# EAGLE design Raspi-On-Off_PMos_SMD_nl (EAGLE 7.4.0)
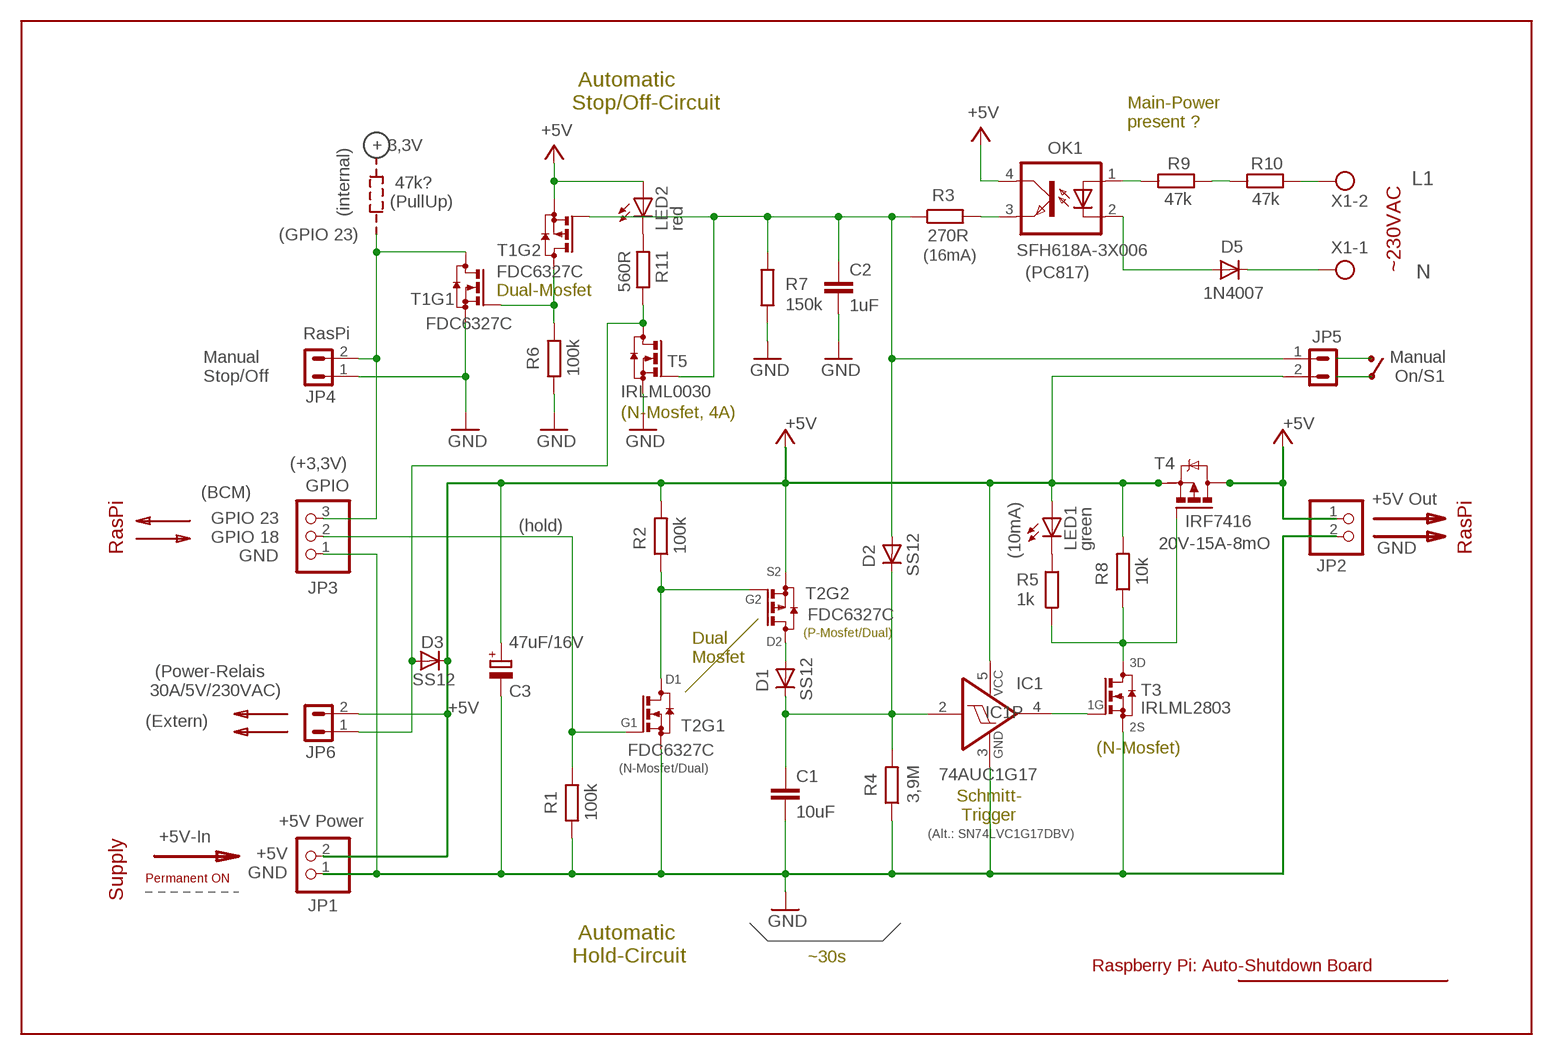
[diagram p0: schematic, sheet 1]

## Parts
C1  10uF  C-EUC1206  [C1206]
C2  1uF  C-EUC0805  [C0805]
C3  47uF/16V  CPOL-EUE2.5-6  [E2,5-6]
D1  SS12  MBR0520LT  [SOD123]
D2  SS12  MBR0520LT  [SOD123]
D3  SS12  MBR0520LT  [SOD123]
D5  1N4007  1N4004  [DO41-10]
IC1  74AUC1G17  74AUC1G17DBV  [SOT23-5]
JP1  +5V Power  PINHD-1X2  [1X02]
JP2  RasPi  PINHD-1X2  [1X02]
JP3  GPIO  PINHD-1X3  [1X03]
JP4  RasPi  MA02-11  [MA02-1R]
JP5  On  MA02-11  [MA02-1R]
JP6  Relais  MA02-11  [MA02-1R]
LED1  green  LED3MM  [LED3MM]
LED2  red  LED3MM  [LED3MM]
OK1  SFH618A-3X006  [DIP4-400]
R1  100k  R-EU_R0805  [R0805]
R2  100k  R-EU_R0805  [R0805]
R3  270R  R-EU_R0805  [R0805]
R4  3,9M  R-EU_R0805  [R0805]
R5  1k  R-EU_R0805  [R0805]
R6  100k  R-EU_R0805  [R0805]
R7  150k  R-EU_R0805  [R0805]
R8  10k  R-EU_R0805  [R0805]
R11  560R  R-EU_R0805  [R0805]
T1  FDC6327C  NP_MOSFET_SOT23-6  [SOT23-6]
T2  FDC6327C  NP_MOSFET_SOT23-6  [SOT23-6]
T3  IRLML2803  BSS12323  [SOT23]
T4  IRF7416  P-MOSFET-SO8  [SO-08]
T5  IRLML0030  BSS12323  [SOT23]
X1  MKDSN1,5/2-5,08  [MKDSN1,5/2-5,08]

## Nets
+5V: C3.+ D3.C IC1.5(VCC) JP1.2 JP5.2 JP6.2 LED1.A LED2.A OK1.4(COL) R2.2 R8.2 T1.2(S) T2.2(S) T4.1(S) T4.2(S) T4.3(S)
GND: C1.2 C2.2 C3.- IC1.3(GND) JP1.1 JP2.2 JP3.1 JP4.1 R1.1 R4.1 R6.1 R7.2 T1.5(S) T2.5(S) T3.2(S) T5.2(S)
N$1: JP2.1 T4.5(D) T4.6(D) T4.7(D) T4.8(D)
N$2: JP3.3 JP4.2 T1.6(D)
N$3: LED1.K(C) R5.2
N$4: R5.1 R8.1 T3.3(D) T4.4(G)
N$5: JP3.2 R1.2 T2.1(G)
N$6: D1.A T2.4(D)
N$7: C1.1 D1.C D2.C IC1.2(I) R4.2
N$8: C2.1 D2.A JP5.1 R3.1 R7.1 T1.3(G) T5.1(G)
N$9: R2.1 T2.3(G) T2.6(D)
N$10: OK1.3(EMIT) R3.2
N$11: R6.2 T1.1(G) T1.4(D)
N$13: OK1.1(A)
N$14: D5.A OK1.2(C)
N$15: D5.C X1.1
N$16: D3.A JP6.1 R11.1 T5.3(D)
N$17: LED2.K(C) R11.2
N$18: X1.2
N$26: IC1.4(O) T3.1(G)

## Notes on the sheet
- Automatic
  Stop/Off-Circuit
- Main-Power
  present ?
- + 3,3V
- R9 | R10
- L1
- 47k | 47k
- 47k?
  (PullUp)
- (internal)
- (GPIO 23)
- (16mA)
- ~230VAC
- (PC817) | N
- Dual-Mosfet
- Manual
  Stop/Off
- Manual
   On/S1
- (N-Mosfet, 4A)
- (+3,3V)
- (BCM)
- +5V Out
- GPIO 23
  GPIO 18
  GND
- (hold)
- RasPi | 20V-15A-8mO | GND | RasPi
- (10mA)
- S2
- G2
- (P-Mosfet/Dual)
- D2
- Dual
  Mosfet
- 3D
- D1
- (Power-Relais
  30A/5V/230VAC)
- 1G
- +5V
- (Extern) | G1
- 2S
- (N-Mosfet)
- (N-Mosfet/Dual)
- Schmitt-
   Trigger
- (Alt.: SN74LVC1G17DBV)
- +5V-In
- +5V
  GND
- Permanent ON
- Supply
- Automatic
  Hold-Circuit
- ~30s
- Raspberry Pi: Auto-Shutdown Board

## Library data of the parts
C1 C2 = rcl:C-EU: CAPACITOR, European symbol
C3 = rcl:CPOL-EU: POLARIZED CAPACITOR, European symbol
D1-D3 = diode2:MBR0520LT: SCHOTTKY BARRIER RECTIFIER Source: http://onsemi.com .. MBR0520LT1-D.pdf
D5 = diode1:1N4004: DIODE general purpose rectifier, 1 A
IC1 = 74xx-little-de:74*1G17: Single Schmitt-Trigger Buffer
JP1 JP2 = pinhead:PINHD-1X2: PIN HEADER
JP3 = pinhead:PINHD-1X3: PIN HEADER
JP4-JP6 = con-lstc:MA02-1: PIN HEADER
LED1 LED2 = led:LED: LED OSRAM: - CHIPLED LG R971, LG N971, LY N971, LG Q971, LY Q971, LO R971, LY R971 LH N974, LH R974 LS Q976, LO Q976, LY Q976 LO Q996 - Hyper CHIPLED LW Q18S LB Q993, LB Q99A, LB R99A - SideLED LS A670, LO A670, LY A670, LG A670, LP A670 LB A673, LV A673, LT A673, LW A673 LH A674 LY A675 LS A676, LA A676, LO A676, LY A676, LW A676 LS A679, LY A679, LG A679 - Hyper Micro SIDELED® LS Y876, LA Y876, LO Y876, LY Y876 LT Y87S - SmartLED LW L88C, LW L88S LB L89C, LB L89S, LG L890 LS L89K, LO L89K, LY L89K LS L896, LA L896, LO L896, LY L896 - TOPLED LS T670, LO T670, LY T670, LG T670, LP T670 LSG T670, LSP T670, LSY T670, LOP T670, LYG T670 LG T671, LOG T671, LSG T671 LB T673, LV T673, LT T673, LW T673 LH T674 LS T676, LA T676, LO T676, LY T676, LB T676, LH T676, LSB T676, LW T676 LB T67C, LV T67C, LT T67C, LS T67K, LO T67K, LY T67K, LW E67C LS E67B, LA E67B, LO E67B, LY E67B, LB E67C, LV E67C, LT E67C LW T67C LS T679, LY T679, LG T679 LS T770, LO T770, LY T770, LG T770, LP T770 LB T773, LV T773, LT T773, LW T773 LH T774 LS E675, LA E675, LY E675, LS T675 LS T776, LA T776, LO T776, LY T776, LB T776 LHGB T686 LT T68C, LB T68C - Hyper Mini TOPLED® LB M676 - Mini TOPLED Santana® LG M470 LS M47K, LO M47K, LY M47K Source: http://www.osram.convergy.de LUXEON: - LUMILED® LXK2-PW12-R00, LXK2-PW12-S00, LXK2-PW14-U00, LXK2-PW14-V00 LXK2-PM12-R00, LXK2-PM12-S00, LXK2-PM14-U00 LXK2-PE12-Q00, LXK2-PE12-R00, LXK2-PE12-S00, LXK2-PE14-T00, LXK2-PE14-U00 LXK2-PB12-K00, LXK2-PB12-L00, LXK2-PB12-M00, LXK2-PB14-N00, LXK2-PB14-P00, LXK2-PB14-Q00 LXK2-PR12-L00, LXK2-PR12-M00, LXK2-PR14-Q00, LXK2-PR14-R00 LXK2-PD12-Q00, LXK2-PD12-R00, LXK2-PD12-S00 LXK2-PH12-R00, LXK2-PH12-S00 LXK2-PL12-P00, LXK2-PL12-Q00, LXK2-PL12-R00 Source: www.luxeon.com KINGBRIGHT: KA-3528ASYC Source: www.kingbright.com
OK1 = optocoupler:SFH618?*: Optocoupler, Phototransistor Output, Low Input Current Source: Data sheet <http://www.vishay.com/docs/83673/sfh618.pdf>; MPN: SFH618A-3X006; OC_FARNELL: unknown; OC_NEWARK: 43K9541
R1-R8 R11 = rcl:R-EU_: RESISTOR, European symbol
T1 T2 = transistor-small-signal:NP_MOSFET_SOT23-6: Dual N- & P-Channel Mosfet 20V / ~2A / ~1W / ~100mO / SOT23-6
T3 T5 = transistor-small-signal:BSS123: N-CHANNEL MOS FET
T4 = transistor-power-1:P-MOSFET-SO8: P-Channel MOSFET Example: FDS4435A; P-Channel Logic Level PowerTrench® MOSFET FDS4465; P-Channel 1.8V Specified PowerTrench® MOSFET Source: www.fairchildsemi.com
X1 = con-phoenix-508:MKDSN1,5/2-5,08: MKDSN 1,5/ 2-5,08 Printklemme Nennstrom: 13,5 A Nennspannung: 250 V Rastermaß: 5,08 mm Polzahl: 2 Anschlussart: Schraubanschluss Montage: Löten Anschlussrichtung Leiter/Platine: 0 ° Artikelnummer: 1729128 Source: http://eshop.phoenixcontact.com .. 1729128.pdf

## Board
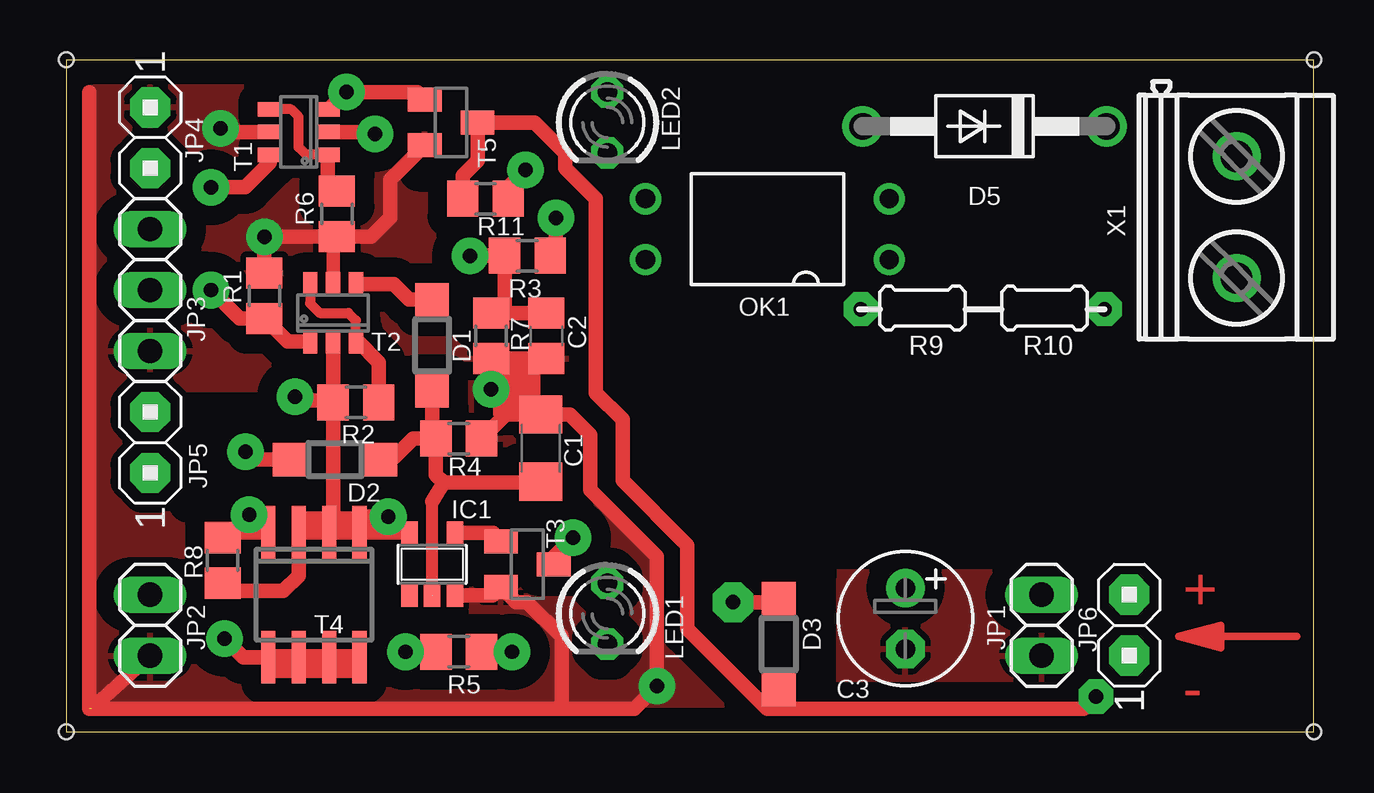
[diagram p1: board, top side]
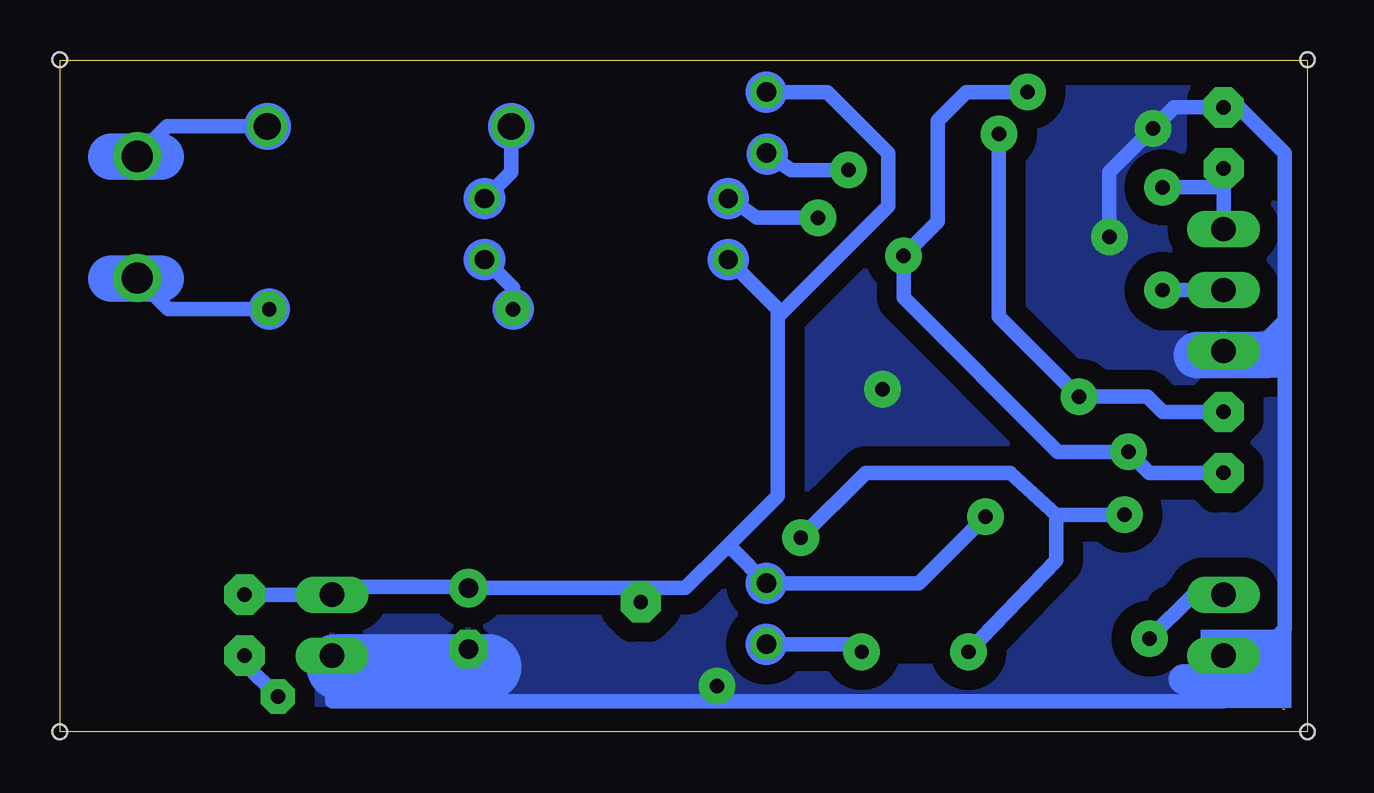
[diagram p2: board, bottom side, seen from below]

Size 51.98 x 28.01 mm. Coordinates in mm from the lower left corner, seen from the top.
Outline: 0,0 51.98,0 51.98,28.01 0,28.01 0,0
Copper layers (1*16): Top 0.035mm / dielectric 1.5mm / Bottom 0.035mm
Design rules "default": minimum track width 10mil, minimum drill 24mil, track to track 8mil, track to pad 8mil, pad to pad 8mil, via to via 8mil, smd to smd 8mil, copper to edge 40mil, drill to drill 8mil, minimum pad ring 10mil, minimum via ring 8mil, stop-mask expansion 4mil, vias tented up to drill 0mil, thermal gap 10mil
Holes 0.6 mm at 0,0 0,28.02 51.99,28.02 51.99,0
tRestrict: area 17.5,6.7 to 18.4,8.9; area 17.8,15.6 to 18.7,19.2; area 5.2,3.7 to 5.9,5.2; area 5.1,9.5 to 8.3,13.3; area 4.8,18.6 to 5.8,19.2; area 45.2,4.6 to 46.2,5.2; area 20.5,7.7 to 21.8,9.5; area 20.2,10.3 to 20.8,13; area 14.7,23.3 to 15.6,24; area 30.6,1.9 to 31.3,6.5
bRestrict: area 1.2,17.5 to 6.1,17.9; area 1,22.9 to 4.2,26.4; area 0.9,4.8 to 2.1,5.1; area 5.2,3.7 to 5.9,5.2; area 5,18.5 to 6,19.1; area 15.5,3.7 to 17.2,4.7

### Footprints (pad centres in the part's own frame; a part is rotated, then mirrored left to right if it is on the bottom)
C1206 = smd 1.6 x 1.8: 1 -1.4,0; 2 1.4,0
C0805 = smd 1.3 x 1.5: 1 -0.95,0; 2 0.95,0
E2,5-6 = drill 0.813 pad 1.6: + -1.27,0 | drill 0.813 pad 1.6 octagon: - 1.27,0
SOD123 = smd 1.4 x 1.4: A 1.9,0; C -1.9,0
DO41-10 = drill 1.118: A 5.08,0; C -5.08,0
SOT23-5 = smd 0.69 x 0.99: 1 -0.95,-1.29; 2 0,-1.29; 3 0.95,-1.29; 4 0.95,1.3; 5 -0.95,1.3
1X02 = drill 1.016 long: 1 -1.27,0; 2 1.27,0
1X03 = drill 1.016 long: 1 -2.54,0; 2 0,0; 3 2.54,0
MA02-1R = drill 0.6 pad 1.676 octagon: 1 0,0; 2 2.54,0
LED3MM = drill 0.813 octagon: A -1.27,0; K 1.27,0
DIP4-400 = drill 0.8: 1 -1.27,-5.08; 2 1.27,-5.08; 3 1.27,5.08; 4 -1.27,5.08
R0805 = smd 1.3 x 1.5: 1 -0.95,0; 2 0.95,0
SOT23-6 = smd 0.6 x 1: 1 -0.95,-1.2; 2 0,-1.2; 3 0.95,-1.2; 4 0.95,1.2; 5 0,1.2; 6 -0.95,1.2
SOT23 = smd 1 x 1.4: 1 -0.95,-1.1; 2 0.95,-1.1; 3 0,1.1
SO-08 = smd 0.6 x 2.2: 1 -1.905,-2.6; 2 -0.635,-2.6; 3 0.635,-2.6; 4 1.905,-2.6; 5 1.905,2.6; 6 0.635,2.6; 7 -0.635,2.6; 8 -1.905,2.6
MKDSN1,5/2-5,08 = drill 1.3 pad 2: 1 -2.561,0.025; 2 2.519,0.025

### Placement (x,y rotation side)
C1  19.76,11.83 90 top
C2  20,16.51 270 top
C3  34.96,4.72 270 top
D1  15.24,16.11 90 top
D2  11.19,11.35 180 top
D3  29.69,3.65 270 top
D5  38.26,25.24 180 top
IC1  15.24,6.99 0 top
JP1  40.64,4.45 90 top
JP2  3.49,4.45 270 top
JP3  3.49,18.41 90 top
JP4  3.49,26.04 270 top
JP5  3.49,10.79 90 top
JP6  44.29,3.17 90 top
LED1  22.54,4.92 270 top
LED2  22.54,25.4 270 top
OK1  29.21,20.95 90 top
R1  8.26,18.18 270 top
R2  12.06,13.73 180 top
R3  19.21,19.84 0 top
R4  16.35,12.22 180 top
R5  16.35,3.33 0 top
R6  11.27,21.59 90 top
R7  17.7,16.51 270 top
R8  6.51,7.14 270 top
R11  17.46,22.23 0 top
T1  9.68,25 90 top
T2  11.11,17.46 0 top
T3  19.21,6.99 270 top
T4  10.32,5.71 180 top
T5  16.03,25.4 270 top
X1  48.74,21.43 270 top

### Tracks (layer width: path | path; a pad name or v marks a point on that pad's centre or on a via)
+5V  (via drill 0.6 pad 1.52, 0.6 pad 1.68)
  Top 0.61: T4.1 T4.2 T4.3 9.68,6.51 9.05,5.87 6.67,5.87 R8.2 | R2.2 11.27,13.97 11.12,13.81 9.68,13.81 v9.53,13.97 | 10,8.89 11.11,8.89 | 11.11,8.89 12.22,8.89 | 12.22,8.89 T4.1 | IC1.5 14.16,8.31 T4.1 | v13.41,8.97 12.46,8.97 12.22,8.89 | T1.2 12.78,25 v12.86,24.92 | T2.2 R2.2 | 11.11,13.81 R2.2 | R2.2 | R2.2 11.11,8.89 | D3.C 29.53,5.4 v27.78,5.4
  Bottom 0.61: 34.92,6.03 C3.+ | C3.+ 35,6.03 40.32,6.03 JP1.2 JP6.2 | 24.29,7.62 25.92,5.99 27.78,5.99 | 24.29,7.62 22.07,9.84 22.07,17.14 22.07,17.3 | C3.+ | JP5.2 6.03,13.34 6.67,13.97 v9.53,13.97 12.86,17.3 v12.86,24.92 | 27.78,5.99 C3.+ | 24.29,7.62 23.97,7.62 LED1.A 16.19,6.19 v13.41,8.97 | 22.07,17.3 22.07,17.62 OK1.4 | LED2.A 20,26.67 17.46,24.13 17.46,21.91 22.07,17.3 | v27.78,5.4 27.78,5.99
GND  (via drill 0.6 pad 1.52)  (1 unrouted)
  Top 0.559: T2.5 11.11,20.32
  Top 0.61: 19.45,15.56 R7.2 v17.7,14.29 | 19.45,15.56 C2.2 | R1.1 v8.26,20.64 10.79,20.64 11.11,20.32 | R6.1 12.7,20.64 13.49,21.43 13.49,23.01 T5.2 | C1.2 20.98,13.23 21.83,12.38 21.83,10.08 24.61,7.3 v24.61,1.91 23.65,0.95 20.64,0.95 | C1.2 18.3,13.23 R4.1 | IC1.3 17.77,5.7 T3.2 18.75,5.4 19.21,5.4 20.64,3.97 20.64,0.95 | JP2.2 1.03,0.95 20.64,0.95 | T1.5 6.59,25 v6.43,25.16 | 0.95,26.67 0.95,0.95 | 19.45,15.56 19.45,13.54 C1.2
  Bottom 0.406: 4.29,15.88 4.6,15.72
  Bottom 0.61: JP1.1 40.64,1.27 24.61,1.27 | v24.61,1.91 24.61,1.27 | 24.61,1.27 3.49,1.27 | 0.95,17.14 0.95,24.13 2.86,26.04 JP4.1 5.56,26.04 v6.43,25.16 8.26,23.34 v8.26,20.64 | 0.95,17.14 2.22,15.88 JP3.1 4.29,15.88 4.6,15.88 | 0.95,17.14 0.95,4.29 2.06,3.17 JP2.2 3.49,1.27 | C3.- 34.21,2.7 34.13,2.7 | 3.49,1.27 3.53,2.18
  Bottom 1.27: 5.16,2.18 3.53,2.18
  Bottom 1.778: JP1.1 40.32,2.7
  Bottom 1.93: 1.67,15.72 4.6,15.72
  Bottom 2.743: 40.32,2.7 34.13,2.7
  pour Bottom (isolate 0.813): -0.32,28.26 23.18,28.26 23.18,10.48 26.99,6.67 41.91,6.67 41.91,-0.32 -0.32,-0.32
  pour Top (isolate 0.813): -0.32,28.26 23.18,28.26 23.18,10.48 26.99,6.67 41.91,6.67 41.91,-0.32 -0.32,-0.32
N$1  (via drill 0.6 pad 1.52)
  Top 0.61: T4.5 8.41,2.54 12.22,2.54 T4.8 | 10.95,3.17 T4.7 T4.8 | T4.5 8.45,3.13 12.22,3.13 T4.8 | T4.5 T4.6 | T4.5 8.39,3.1 7.38,3.1 v6.59,3.89
  Bottom 0.61: JP2.1 4.76,5.71 v6.59,3.89
N$2  (via drill 0.6 pad 1.52)
  Top 0.559: T1.6 8.48,23.72
  Top 0.61: 8.48,23.72 7.46,22.7 v6.03,22.7
  Bottom 0.61: JP4.2 3.49,22.7 | 3.49,22.7 JP3.3 | v6.03,22.7 3.49,22.7
N$3  (via drill 0.6 pad 1.52)
  Top 0.61: v18.57,3.33 R5.2
  Bottom 0.61: LED1.K 18.89,3.65 v18.57,3.33
N$4  (via drill 0.6 pad 1.52)
  Top 0.61: T3.3 20.31,7.29 v21.11,8.1 | R5.1 v14.13,3.33 | T4.4 6.57,8.31 R8.1 6.35,8.1 6.67,8.1 v7.62,9.05
  Bottom 0.61: 10.48,9.05 v7.62,9.05 8.89,9.05 | 10.48,9.05 12.38,10.79 18.41,10.79 v21.11,8.1 | v14.13,3.33 10.48,7.14 10.48,9.05
N$5  (via drill 0.6 pad 1.52)
  Top 0.61: T2.1 9.22,16.26 R1.2 7.22,17.23 v6.03,18.41
  Bottom 0.61: JP3.2 v6.03,18.41
N$6
  Top 0.508: T2.4 12.06,18.57
  Top 0.559: T2.4 12.06,18.81
  Top 0.61: D1.A 14.29,18.01 13.64,18.66 T2.4
N$7
  Top 0.508: IC1.2 15.24,9.6
  Top 0.61: 15.32,12.62 R4.2 | D1.C 15.24,14.61 15.24,12.38 R4.2 | D2.C 13.17,11.43 13.65,11.43 14.45,12.22 R4.2 | 15.24,9.6 15.72,10.4 | 15.72,10.4 15.4,10.72 R4.2 | 15.72,10.4 19.18,10.4 C1.1
N$8  (via drill 0.6 pad 1.52)
  Top 0.559: T1.3 11.28,26.35
  Top 0.61: 18.26,17.46 R7.1 17.94,17.7 | 18.26,17.46 C2.1 | D2.A 7.78,11.35 v7.46,11.67 | T5.1 14.62,26.67 v11.67,26.67 11.6,26.67 11.28,26.35 | v16.83,19.84 R3.1 18.26,17.46
  Bottom 0.61: JP5.1 6.59,10.79 v7.46,11.67 10.4,11.67 16.83,18.1 v16.83,19.84 15.4,21.27 15.4,25.48 14.21,26.67 v11.67,26.67
N$9
  Top 0.406: T2.6 10.16,17.86 10.56,17.46 11.75,17.46 12.06,17.15 T2.3
  Top 0.508: T2.6
  Top 0.61: R2.1 13.02,15.4 12.15,16.26 T2.3
N$10  (via drill 0.6 pad 1.52)
  Top 0.61: R3.2 20.4,20.16 v20.4,21.43
  Bottom 0.61: v20.4,21.43 22.94,21.43 24.05,22.23 OK1.3
N$11
  Top 0.406: T1.1 10,24.05 9.68,24.37 9.68,25.64 9.37,25.95 T1.4
  Top 0.61: 11.43,22.86 R6.2 10.88,22.93 T1.1
N$13
  Bottom 0.61: OK1.1 33.1,18.49 33.11,17.63
N$14
  Bottom 0.61: D5.A 33.18,23.34 OK1.2 | OK1.2
N$15
  Bottom 0.61: D5.C 47.51,25.24 X1.1 | X1.1 | X1.1 | 47.8,23.99 47.78,23.97 | X1.1 48.74,23.97
  Bottom 1.93: 47.78,23.97 48.74,23.97 49.85,23.97
N$16  (via drill 0.6 pad 1.42)
  Top 0.61: 29.69,0.95 29.21,0.95 25.88,4.29 25.88,7.78 23.18,10.48 23.18,13.02 22.07,14.13 22.07,22.23 20.8,23.5 20.8,24.13 19.53,25.4 T5.3 17.13,23.8 16.51,23.18 R11.1 | 29.69,0.95 42.39,0.95 v42.9,1.47 | D3.A 29.69,0.95
  Bottom 0.61: JP6.1 44.29,2.86 v42.9,1.47
N$17  (via drill 0.6 pad 1.52)
  Top 0.61: R11.2 18.41,22.7 v19.13,23.42
  Bottom 0.61: v19.13,23.42 21.51,23.42 LED2.K
N$18  (via drill 0.6 pad 1.42)
  Bottom 0.61: 48.74,18.89 X1.2 47.47,17.62 v43.26,17.62
  Bottom 1.93: 49.85,18.89 48.74,18.89 47.78,18.89
N$21  (via drill 0.6 pad 1.42)
  other vias: 33.1,17.62
N$24
  Top 0.305: 46.35,3.97 47.15,3.97 | 47.15,3.97 51.28,3.97 | 46.35,3.97 48.1,4.45 48.1,4.29 | 48.1,4.29 48.1,3.65 | 48.1,3.65 48.1,3.49 46.35,3.97 | 48.1,4.29 47.15,3.97 | 47.15,3.97 48.1,3.65
N$26
  Top 0.61: IC1.4 17.79,8.29 T3.1
(copper drawn outside any net)
  shapes: Bottom area x2, Bottom circle x12, Top area x2

### Text on the board
Top: + | -
tNames: R9 | R10
tValues: Button | Stop | 23 | (PC817) | 18 | 47k | 47k | ~230VAC | GND | +5V | Button | +5V | +5V | Power- | +5V | Supply | GND | GND